# Altium schematic sheet CAN_PHY.SchDoc
size A3; SheetNumber: 19; SheetTotal: 23
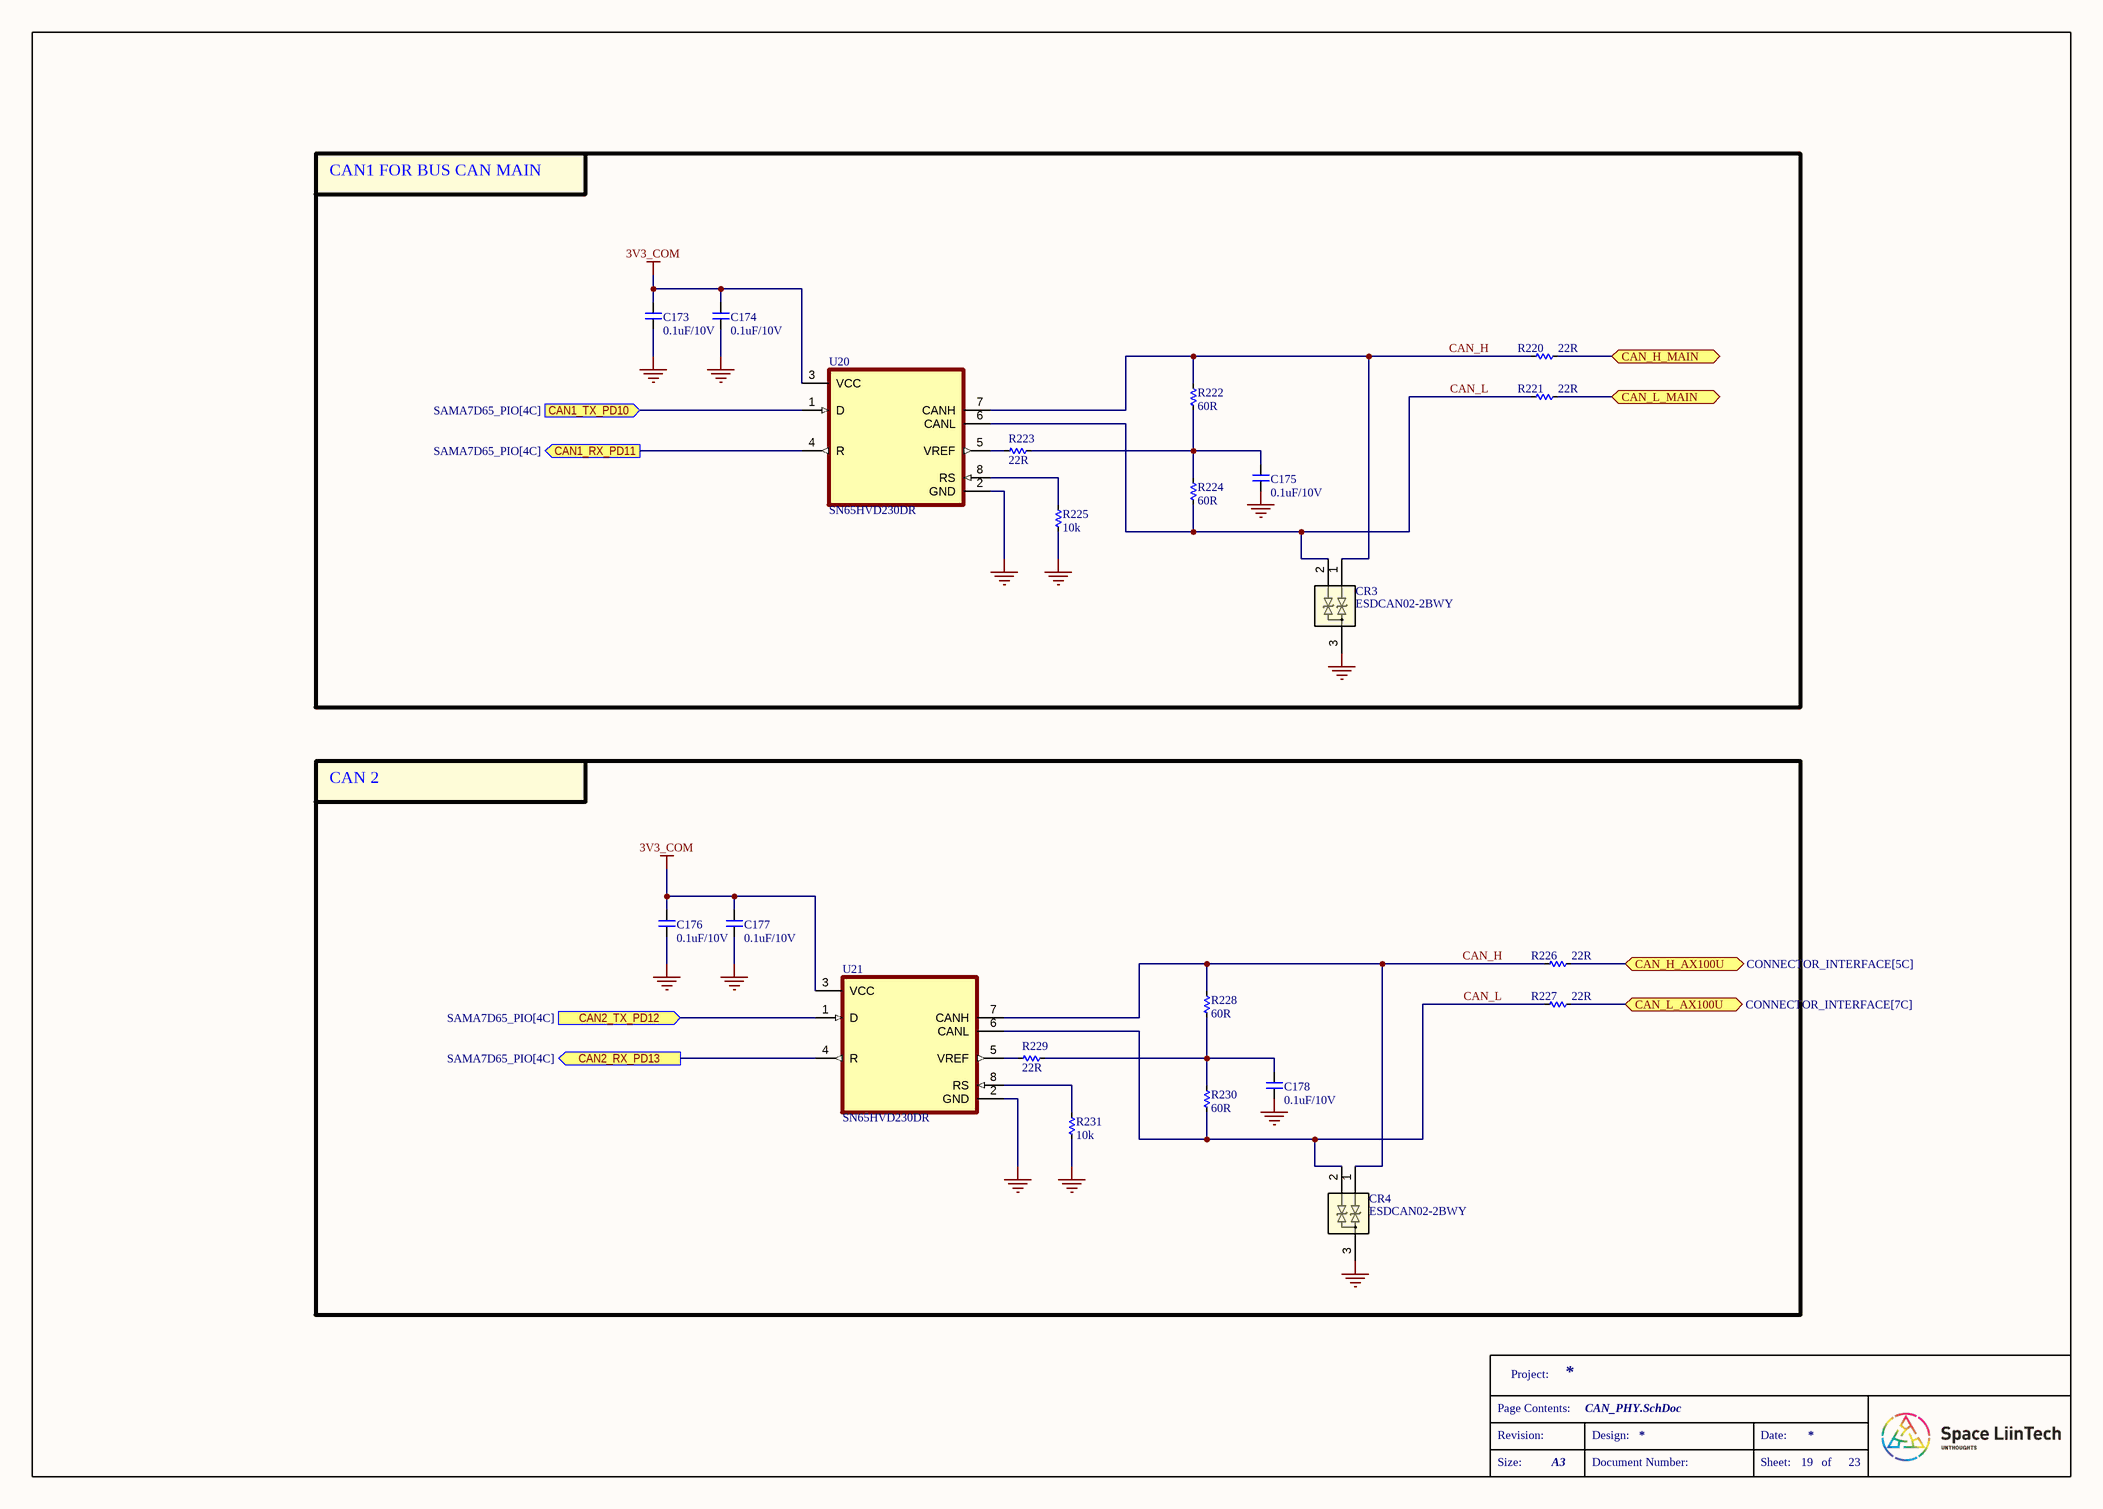
[diagram p0: CAN_PHY.SchDoc]

## Parts
C173  0.1uF/10V  [CAP_C_1005X50_L]
C174  0.1uF/10V  [CAP_C_1005X50_L]
C175  0.1uF/10V  [CAP_C_1005X50_L]
C176  0.1uF/10V  [CAP_C_1005X50_L]
C177  0.1uF/10V  [CAP_C_1005X50_L]
C178  0.1uF/10V  [CAP_C_1005X50_L]
CR3  ESDCAN02-2BWY  [SOT323-3L_STM]
CR4  ESDCAN02-2BWY  [SOT323-3L_STM]
R220  22R  [RES_C_1005x30_L]
R221  22R  [RES_C_1005x30_L]
R222  60R  [RES_C_1005x30_L]
R223  22R  [RES_C_1005x30_L]
R224  60R  [RES_C_1005x30_L]
R225  10k  [RES_C_1005x30_L]
R226  22R  [RES_C_1005x30_L]
R227  22R  [RES_C_1005x30_L]
R228  60R  [RES_C_1005x30_L]
R229  22R  [RES_C_1005x30_L]
R230  60R  [RES_C_1005x30_L]
R231  10k  [RES_C_1005x30_L]
U20  SN65HVD230DR  [SOIC127P599X175-8N]
U21  SN65HVD230DR  [SOIC127P599X175-8N]

## Blocks framed on the sheet
CAN1 FOR BUS CAN MAIN: C173-C175 CR3 R220-R225 U20
CAN 2: C176-C178 CR4 R226-R231 U21

## Ports
CAN1_RX_PD11 (out, see SAMA7D65_PIO[4C]), CAN1_TX_PD10 (in, see SAMA7D65_PIO[4C]), CAN2_RX_PD13 (out, see SAMA7D65_PIO[4C]), CAN2_TX_PD12 (in, see SAMA7D65_PIO[4C]), CAN_H_AX100U (bidir, see CONNECTOR_INTERFACE[5C]), CAN_H_MAIN (bidir, see CONNECTOR_EXP[4B], CONNECTOR_INTERFACE[4A], CONNECTOR_INTERFACE[5C]), CAN_L_AX100U (bidir, see CONNECTOR_INTERFACE[7C]), CAN_L_MAIN (bidir, see CONNECTOR_EXP[4B], CONNECTOR_INTERFACE[4A], CONNECTOR_INTERFACE[7C])

## Nets
3V3_COM: C173.2 C174.2 C176.2 C177.2 U20.3(VCC) U21.3(VCC)
GND: C173.1 C174.1 C175.1 C176.1 C177.1 C178.1 CR3.3 CR4.3 R225.2 R231.2 U20.2(GND) U21.2(GND)
CAN1_RX_PD11: U20.4(R) ; port CAN1_RX_PD11
CAN1_TX_PD10: U20.1(D) ; port CAN1_TX_PD10
CAN2_RX_PD13: U21.4(R) ; port CAN2_RX_PD13
CAN2_TX_PD12: U21.1(D) ; port CAN2_TX_PD12
CAN_H: CR3.1 CR4.1 R220.1 R222.1 R226.1 R228.1 U20.7(CANH) U21.7(CANH)
CAN_H_AX100U: R226.2 ; port CAN_H_AX100U
CAN_H_MAIN: R220.2 ; port CAN_H_MAIN
CAN_L: CR3.2 CR4.2 R221.1 R224.2 R227.1 R230.2 U20.6(CANL) U21.6(CANL)
CAN_L_AX100U: R227.2 ; port CAN_L_AX100U
CAN_L_MAIN: R221.2 ; port CAN_L_MAIN
NetC175_2: C175.2 R222.2 R223.1 R224.1
NetC178_2: C178.2 R228.2 R229.1 R230.1
NetR223_2: R223.2 U20.5(VREF)
NetR225_1: R225.1 U20.8(RS)
NetR229_2: R229.2 U21.5(VREF)
NetR231_1: R231.1 U21.8(RS)

## Notes on the sheet
- Project:
- Page Contents:
- Revision:
- Design:
- Date:
- Size:
- A3
- Document Number:
- Sheet:
- of

## Library data of the parts
C173-C178 = _CAP_C_2: CAP CHIP
CR3 CR4 = ESDCAN02-2BWY: TVS DIODE 26.5VWM 44VC SOT3233; Manufacturer_Name: STMicroelectronics; Copyright: Copyright (C) 2025 Ultra Librarian. All rights reserved.; Manufacturer_Part_Number: ESDCAN02-2BWY; RefDes: RefDes; Type: Type
R220-R231 = _RES_B_2: RES
U20 U21 = SN65HVD230DR: 3.3 V CAN Transceiver with Standby Mode; MF: Texas Instruments; SnapEDA_Link: https://www.snapeda.com/parts/SN65HVD230DR/Texas+Instruments/view-part/?ref=snap; Package: SOIC-8 Texas Instruments; Value: *; MP: SN65HVD230DR; Check_prices: https://www.snapeda.com/parts/SN65HVD230DR/Texas+Instruments/view-part/?ref=eda